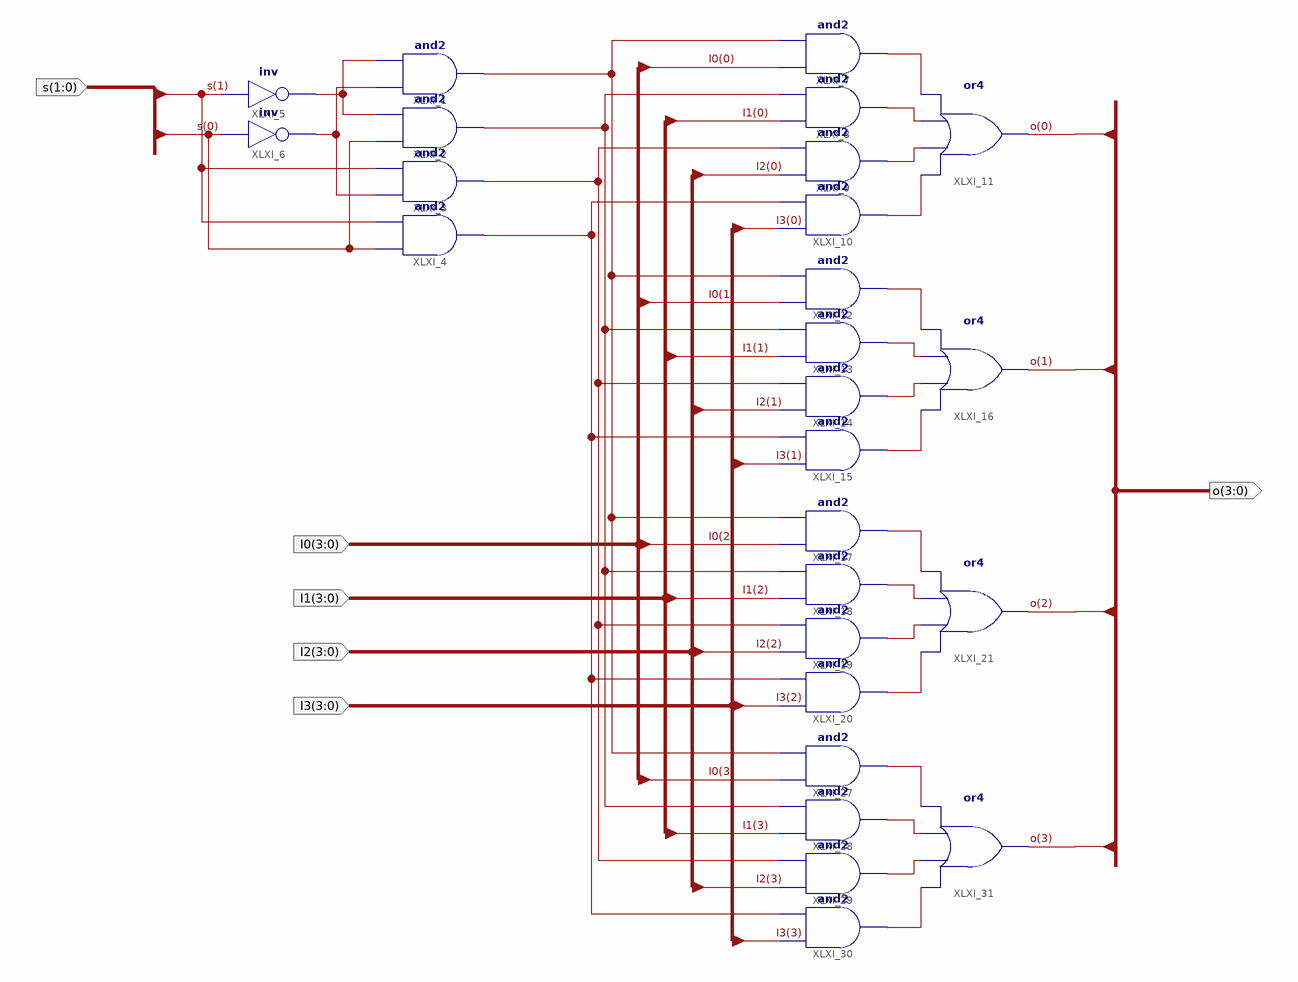
[diagram p0: schematic sheet 1]
// Xilinx ISE schematic MUX4T1_4.sch (kintex7) as structural Verilog: 26 symbols, 6 ports
module MUX4T1_4 (
  input  [1:0] s,
  input  [3:0] I0,
  input  [3:0] I1,
  input  [3:0] I2,
  input  [3:0] I3,
  output [3:0] o
);

  wire XLXN_5, XLXN_9, XLXN_13, XLXN_14, XLXN_15, XLXN_16, XLXN_21, XLXN_22, XLXN_23, XLXN_25, XLXN_26,
       XLXN_27, XLXN_28, XLXN_30, XLXN_36, XLXN_37, XLXN_38, XLXN_40, XLXN_49, XLXN_51, XLXN_54, XLXN_56;

  and XLXI_1 (XLXN_49, XLXN_9, XLXN_5);
  and XLXI_2 (XLXN_51, s[0], XLXN_5);
  and XLXI_3 (XLXN_54, XLXN_9, s[1]);
  and XLXI_4 (XLXN_56, s[0], s[1]);
  not XLXI_5 (XLXN_5, s[1]);
  not XLXI_6 (XLXN_9, s[0]);
  or XLXI_11 (o[0], XLXN_16, XLXN_15, XLXN_14, XLXN_13);
  or XLXI_16 (o[1], XLXN_22, XLXN_25, XLXN_23, XLXN_21);
  or XLXI_21 (o[2], XLXN_27, XLXN_30, XLXN_28, XLXN_26);
  or XLXI_31 (o[3], XLXN_37, XLXN_40, XLXN_38, XLXN_36);
  and XLXI_27 (XLXN_36, I0[3], XLXN_49);
  and XLXI_28 (XLXN_38, I1[3], XLXN_51);
  and XLXI_29 (XLXN_40, I2[3], XLXN_54);
  and XLXI_30 (XLXN_37, I3[3], XLXN_56);
  and XLXI_17 (XLXN_26, I0[2], XLXN_49);
  and XLXI_18 (XLXN_28, I1[2], XLXN_51);
  and XLXI_19 (XLXN_30, I2[2], XLXN_54);
  and XLXI_20 (XLXN_27, I3[2], XLXN_56);
  and XLXI_12 (XLXN_21, I0[1], XLXN_49);
  and XLXI_13 (XLXN_23, I1[1], XLXN_51);
  and XLXI_14 (XLXN_25, I2[1], XLXN_54);
  and XLXI_15 (XLXN_22, I3[1], XLXN_56);
  and XLXI_7 (XLXN_13, I0[0], XLXN_49);
  and XLXI_8 (XLXN_14, I1[0], XLXN_51);
  and XLXI_9 (XLXN_15, I2[0], XLXN_54);
  and XLXI_10 (XLXN_16, I3[0], XLXN_56);
endmodule
